# EAGLE design Adafruit TSSP77038 IR Demodulator Breakout (EAGLE 9.6.2)
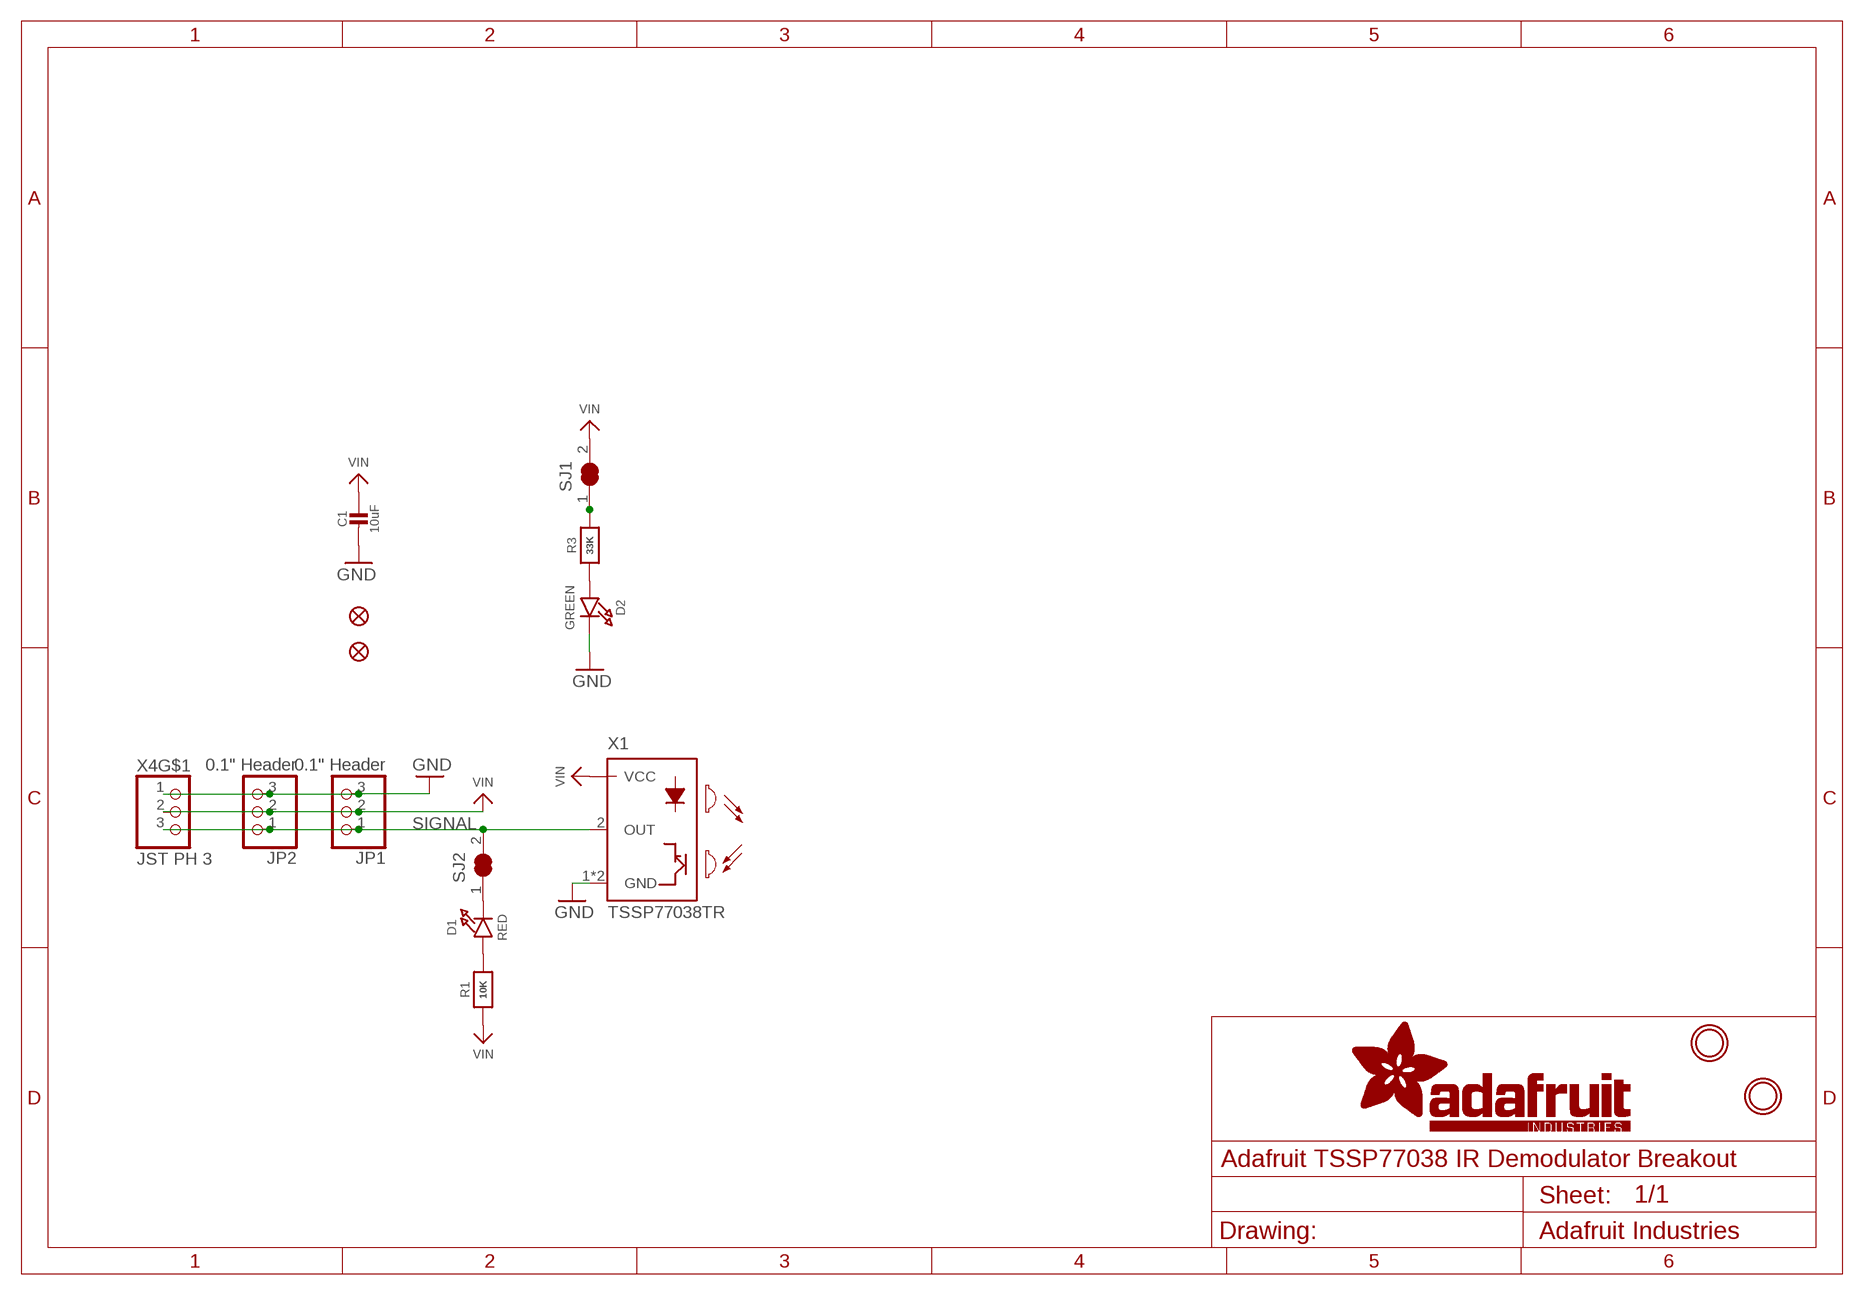
[diagram p0: schematic, sheet 1]

## Parts
C1  10uF  CAP_CERAMIC0805-NOOUTLINE  [0805-NO]
D1  RED  LED0603_NOOUTLINE  [CHIPLED_0603_NOOUTLINE]
D2  GREEN  LED0603_NOOUTLINE  [CHIPLED_0603_NOOUTLINE]
FID2  FIDUCIAL_1MM  [FIDUCIAL_1MM]
FID3  FIDUCIAL_1MM  [FIDUCIAL_1MM]
JP1  0.1" Header  HEADER-1X3  [1X03_OVAL]
JP2  0.1" Header  HEADER-1X376MIL  [1X03_ROUND_76]
R1  10K  RESISTOR_0603_NOOUT  [0603-NO]
R3  33K  RESISTOR_0603_NOOUT  [0603-NO]
SJ1  SOLDERJUMPER_CLOSED  [SOLDERJUMPER_CLOSEDWIRE]
SJ2  SOLDERJUMPER_CLOSED  [SOLDERJUMPER_CLOSEDWIRE]
U$1  MOUNTINGHOLE2.5  [MOUNTINGHOLE_2.5_PLATED]
U$8  MOUNTINGHOLE2.5  [MOUNTINGHOLE_2.5_PLATED]
X1  TSSP77038TR  TSSP770XXTR  [VEML7700]
X4  JST PH 3  CON_JST_PH_3PIN  [JSTPH3]

## Nets
GND: C1.2 D2.C JP1.3 JP2.3 X1.1(GND) X1.4(GND) X4.1
N$1: R3.2 SJ1.1
N$2: D1.C SJ2.1
N$3: D1.A R1.2
N$26: D2.A R3.1
SIGNAL: JP1.1 JP2.1 SJ2.2 X1.2(OUT) X4.3
VIN: C1.1 JP1.2 JP2.2 R1.1 SJ1.2 X1.3(VCC) X4.2
Unconnected: X4.NC1(MT) X4.NC2(MT)

## Library data of the parts
C1 = microbuilder:CAP_CERAMIC: Ceramic Capacitors For new designs, use the packages preceded by an '_' character since they are more reliable: The following footprints should be used on most boards: _0402 - Standard footprint for regular board layouts _0603 - Standard footprint for regular board layouts _0805 - Standard footprint for regular board layouts _1206 - Standard footprint for regular board layouts For extremely tight-pitch boards where space is at a premium, the following 'micro-pitch' footprints can be used (smaller pads, no silkscreen outline, etc.): _0402MP - Micro-pitch footprint for very dense/compact boards _0603MP - Micro-pitch footprint for very dense/compact boards _0805MP - Micro-pitch footprint for very dense/compact boards _1206MP - Micro-pitch footprint for very dense/compact boards
D1 D2 = microbuilder:LED: LED 0603 - 0603 Surface Mount Package 2mA: Green LED - Low Power (3.9mcd, 2ma, 1.7Vf) - Digikey: 475-2709-2-ND Orange LED - Low Power (9.8mcd, 2ma, 1.8Vf) - Digikey: 475-1194-2-ND Red LED - Low Power (5mcd, 2ma, 1.8Vf) - Digikey: 475-1195-2-ND Yellow LED - Low Power (7mcd, 2ma, 1.8Vf) - Digikey: 475-1196-2-ND 5mA: Blue LED - Low Power (17mcd, 5ma, 2.9Vf) - Digikey: LNJ937W8CRACT-ND 0805 - 0805 Surface Mount Package 2mA: Red LED (8.8mcd, 2mA, 1.8Vf, Clear) - Low Power [Digikey: 475-2510-1-ND] Green LED (5mcd, 2mA, 1.8Vf, Clear) - Low Power [Digikey: 475-2730-1-ND] Yellow LED (11.3mcd, 2mA, 1.8Vf, Clear) - Low Power [Digikey: 475-2555-1-ND] 20mA: Red LED (104mcd, 20mA, Diffused) - LS R976 [Digikey: 475-1278-6-ND] Red LED (12mcd, 20mA, 2.0Vf, Clear) - APT2012EC [Digikey: 754-1128-1-ND] Green LED (15mcd, 20mA, 2.2Vf, Clear) - APT2012GC [Digikey: 754-1131-1-ND] Orange LED (160mcd, 20mA, 2.1Vf, Clear) - APT2012SECK [Digikey: 754-1130-1-ND] 1206 - 1206 Surface Mount Package Green LED (26mcd, 20mA, Diffused) - LG N971 [Digikey: 475-1407-6-ND] Red LED (15mcd, 20mA, Diffused) - LH N974 [Digikey: 475-1416-6-ND] Cree - Cree High-Power Surface Mount LEDs XPEBWT-L1-0000-00D50 - White 111lm 350mA 2.9Vf 6200K 110° XTEAWT-00-0000-00000LEE3 - White 114lm 350mA 2.85Vf 5000K 115° Everlight - Everlight 45-21 Series Surface Mount LEDs 45-21/QK2C-B2832AC2CB2/2T - Warm White 2000mcd 20mA 3.25Vf 3050K 120° 45-21/LK2C-B38452C4CB2/2T - Nuetral White 2000mcd 20mA 3.25Vf 4150K 120° 45-21/LK2C-B50634C6CB2/2T - Cold White 2200mcd 20mA 3.25Vf 5650K 120° PLCC2 Reverse Mount LS T77K-J1L2-1-0-2-R18-Z - Red 11.25mcd 2mA 1.8Vf 630nm 120° LO T77K-L1M2-24-Z - Orange 19.6mcd 2mA 1.8Vf 606nm 120° LY T77K-K2M1-26-Z - Yellow 15.7mcd 2mA 1.8Vf 587nm 120°; ROT: 270
FID2 FID3 = microbuilder:FIDUCIAL: Fiducial Alignment Points Various fiducial points for machine vision alignment.; BOM: EXCLUDE
JP1 JP2 = microbuilder:HEADER-1X3: PIN HEADER
R1 R3 = microbuilder:RESISTOR: Resistors For new designs, use the packages preceded by an '_' character since they are more reliable: The following footprints should be used on most boards: _0402 - Standard footprint for regular board layouts _0603 - Standard footprint for regular board layouts _0805 - Standard footprint for regular board layouts _1206 - Standard footprint for regular board layouts For extremely tight-pitch boards where space is at a premium, the following 'micro-pitch' footprints can be used (smaller pads, no silkscreen outline, etc.): _0402MP - Micro-pitch footprint for very dense/compact boards _0603MP - Micro-pitch footprint for very dense/compact boards _0805MP - Micro-pitch footprint for very dense/compact boards _1206MP - Micro-pitch footprint for very dense/compact boards
SJ1 SJ2 = microbuilder:SOLDERJUMPER_CLOSED: Solder Jumper - Closed These solder jumpers are closed by default CLOSEDWIRE - 10 mil trace between pads that can be cut and resoldered later CLOSEDPERM - 63 mil trace between pads for a permanent connection (used to 'bridge' two signals, a shameless hack for Eagle). Can double as a test point as well (no cream layer)
U$1 U$8 = adafruit_electromech:MOUNTINGHOLE: Mounting Hole For #2 screws (0.086"/2.18mm width, 0.094"/2.4mm hole) use 2.5mm; BOM: EXCLUDE
X1 = adafruit_sensor:TSSP770XX
X4 = adafruit_electromech:CON_JST_PH_3PIN

## Net classes
1 HV: width 0.406 mm, drill 0.381 mm, clearance 0.762 mm

## Board
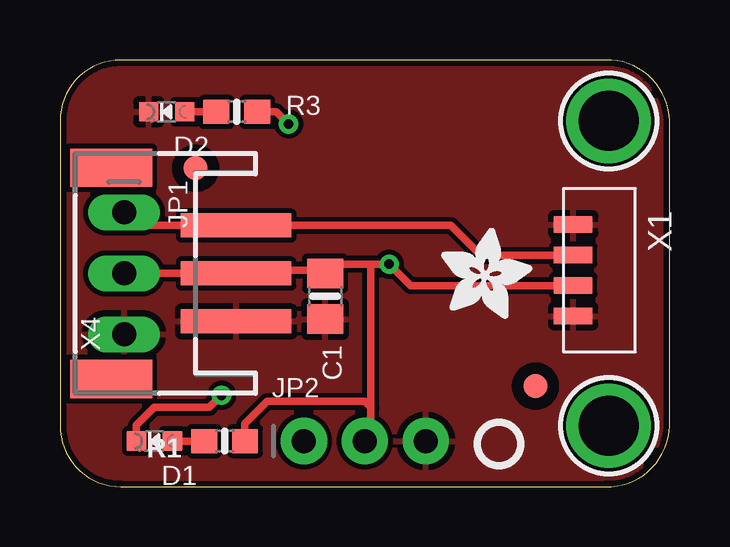
[diagram p1: board, top side]
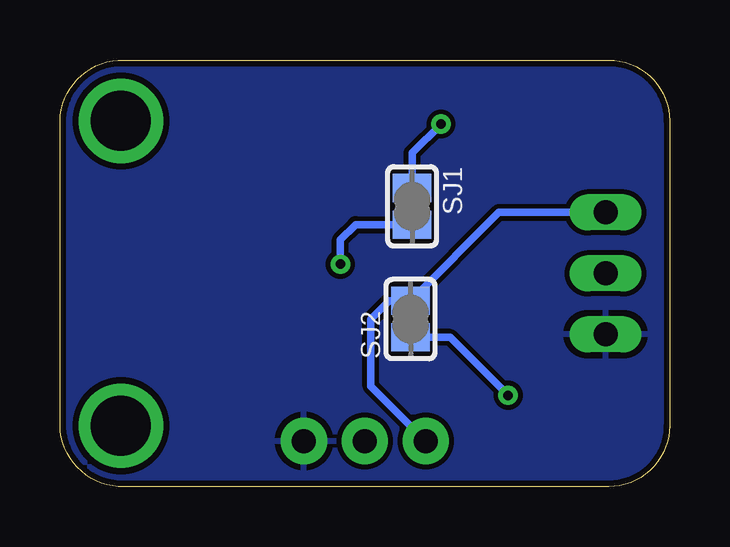
[diagram p2: board, bottom side, seen from below]

Size 25.4 x 17.78 mm. Coordinates in mm from the lower left corner, seen from the top.
Outline: 0,15.24 0,2.54 arc90 2.54,0 22.73,0 arc90 25.4,2.54 25.4,15.24 arc90 22.73,17.78 2.54,17.78 arc90 0,15.24
Copper layers (1*16): Top 0.035mm / dielectric 1.5mm / Bottom 0.035mm
Design rules "adafruit": minimum track width 8mil, minimum drill 15.5mil, track to track 8mil, track to pad 8mil, pad to pad 8mil, via to via 8mil, smd to smd 8mil, copper to edge 10mil, drill to drill 8mil, minimum pad ring 10mil, minimum via ring 8mil, stop-mask expansion 2mil, vias tented up to drill 20mil, thermal gap 10mil

### Footprints (pad centres in the part's own frame; a part is rotated, then mirrored left to right if it is on the bottom)
0805-NO = smd 1.24 x 1.5: 1 -0.95,0; 2 0.95,0
CHIPLED_0603_NOOUTLINE = smd 0.8 x 0.8: A 0,-0.75; C 0,0.75
FIDUCIAL_1MM = smd 1 x 1: 1 0,0
1X03_OVAL = drill 1 long: 1 -2.54,0; 2 0,0; 3 2.54,0
1X03_ROUND_76 = drill 1 pad 1.93: 1 -2.54,0; 2 0,0; 3 2.54,0
0603-NO = smd 1.075 x 1: 1 -0.85,0; 2 0.85,0
SOLDERJUMPER_CLOSEDWIRE = smd 1.168 x 1.6: 1 -0.762,0; 2 0.762,0 | smd 0.635 x 0.203: WIRE 0,0
MOUNTINGHOLE_2.5_PLATED = drill 2.5 pad 3.2: P$1 0,0
VEML7700 = smd 0.7 x 1.6: 1 -1.905,-0.084; 2 -0.635,-0.084; 3 0.635,-0.084; 4 1.905,-0.084
JSTPH3 = smd 1 x 4.6: 1 -2,-2.7; 2 0,-2.7; 3 2,-2.7 | smd 1.6 x 3.4: NC1 -4.4,2.5; NC2 4.4,2.5

### Placement (x,y rotation side)
C1  11.05,7.94 270 top
D1  3.94,1.91 90 top
D2  4.45,15.62 90 top
FID2  19.81,4.19 0 top
FID3  5.65,13.27 0 top
JP1  2.67,8.89 270 top
JP2  12.7,1.91 0 top
PLABEL0  [PLABEL0]  0.64,15.11 0 top
PLABEL1  [PLABEL1]  0.51,1.52 0 top
PLABEL5  [PLABEL5]  12.32,5.71 90 bottom
PLABEL6  [PLABEL6]  12.06,10.54 90 bottom
PLABEL8  [PLABEL8]  4.32,8.89 0 bottom
PLABEL9  [PLABEL9]  4.32,6.35 0 bottom
PLABEL10  [PLABEL10]  1.52,15.24 0 bottom
PLABEL13  [PLABEL13]  11.43,3.56 0 bottom
PLABEL14  [PLABEL14]  14.1,3.56 0 bottom
PLABEL15  [PLABEL15]  14.35,14.48 0 top
PLABEL16  [PLABEL16]  10.16,4.19 90 top
PLABEL17  [PLABEL17]  12.7,4.32 90 top
PLABEL18  [PLABEL18]  15.24,4.57 90 top
PLABEL19  [PLABEL19]  4.32,11.43 0 bottom
PLABEL20  [PLABEL20]  8.76,3.56 0 bottom
PLABEL21  [PLABEL21]  25.27,8.64 0 bottom
R1  6.86,1.91 180 top
R3  7.37,15.62 0 top
SJ1  10.73,11.68 270 bottom
SJ2  10.79,6.99 90 bottom
U$1  22.86,2.54 0 top
U$5  [PCBFEAT-REV-040]  18.29,1.78 180 top
U$8  22.86,15.24 0 top
U$10  [ADAFRUIT_3.5MM]  15.88,6.99 0 top
X1  21.46,9.02 270 top
X4  4.64,8.89 90 top

### Tracks (layer width: path | path; a pad name or v marks a point on that pad's centre or on a via)
GND
  pour Top: 0,17.78 25.4,17.78 25.4,0 0,0
  pour Bottom: 0,17.78 25.4,17.78 25.4,0 0,0
N$1  (via drill 0.39)
  Top 0.305: v9.53,15.11 9.02,15.62 R3.2
  Bottom 0.305: SJ1.1 10.73,13.91 v9.53,15.11
N$2  (via drill 0.39)
  Top 0.305: D1.C 3.19,2.55 3.94,3.3 6.22,3.3 v6.73,3.81
  Bottom 0.305: v6.73,3.81 9.14,6.22 SJ2.1
N$3
  Top 0.305: D1.A R1.2
N$26
  Top 0.305: R3.1 D2.A
SIGNAL
  Top 0.305: X1.2 17.53,9.65 16.29,10.89 X4.3 3.21,10.89 JP1.1
  Bottom 0.305: JP2.1 12.45,4.19 12.45,6.99 11.68,7.75 SJ2.2 7.11,11.43 JP1.1
VIN  (via drill 0.39)
  Top 0.305: X1.3 14.61,8.38 v13.72,9.27 12.95,9.27 | 12.95,9.27 11.43,9.27 C1.1 10.92,9.02 6.6,9.02 6.73,8.89 X4.2 JP1.2 | JP2.2 12.95,2.16 12.95,3.3 | 12.95,3.3 12.95,9.27 | R1.1 7.71,2.63 8.64,3.56 12.7,3.56 12.95,3.3
  Bottom 0.305: v13.72,9.27 13.72,10.29 13.08,10.92 SJ1.2

### Text on the board
Pinguin_tBackup: ON | Signal High / To Send | TSSP77038 / 38 KHz IR / Demodulator | SIG | VIN | GND | 940nm Infrared / LED Emitters | Sig
Pinguin_bBackup: Logic/Power: 3~5VDC | 100mA+ Current/LED | In | Sig | On | V+ | TSSP77038 / 38KHz IR / Demodulator | GND | Sig | Optional / 5mm LED | In | Sig | V+ | GND